# Altium schematic sheet NODE_MCU_V2.SchDoc: PDOA Kit Node
size A3; Organization: Decawave Ltd.; Address1: Adelaide Chambers,; Address2: Peter Street,; Address3: Dublin 8,; Address4: Ireland.; DocumentNumber: 2; Revision: 2v2; SheetNumber: 2; SheetTotal: 5; SheetFunction: MCU; ProjectName: PDOA Kit Node
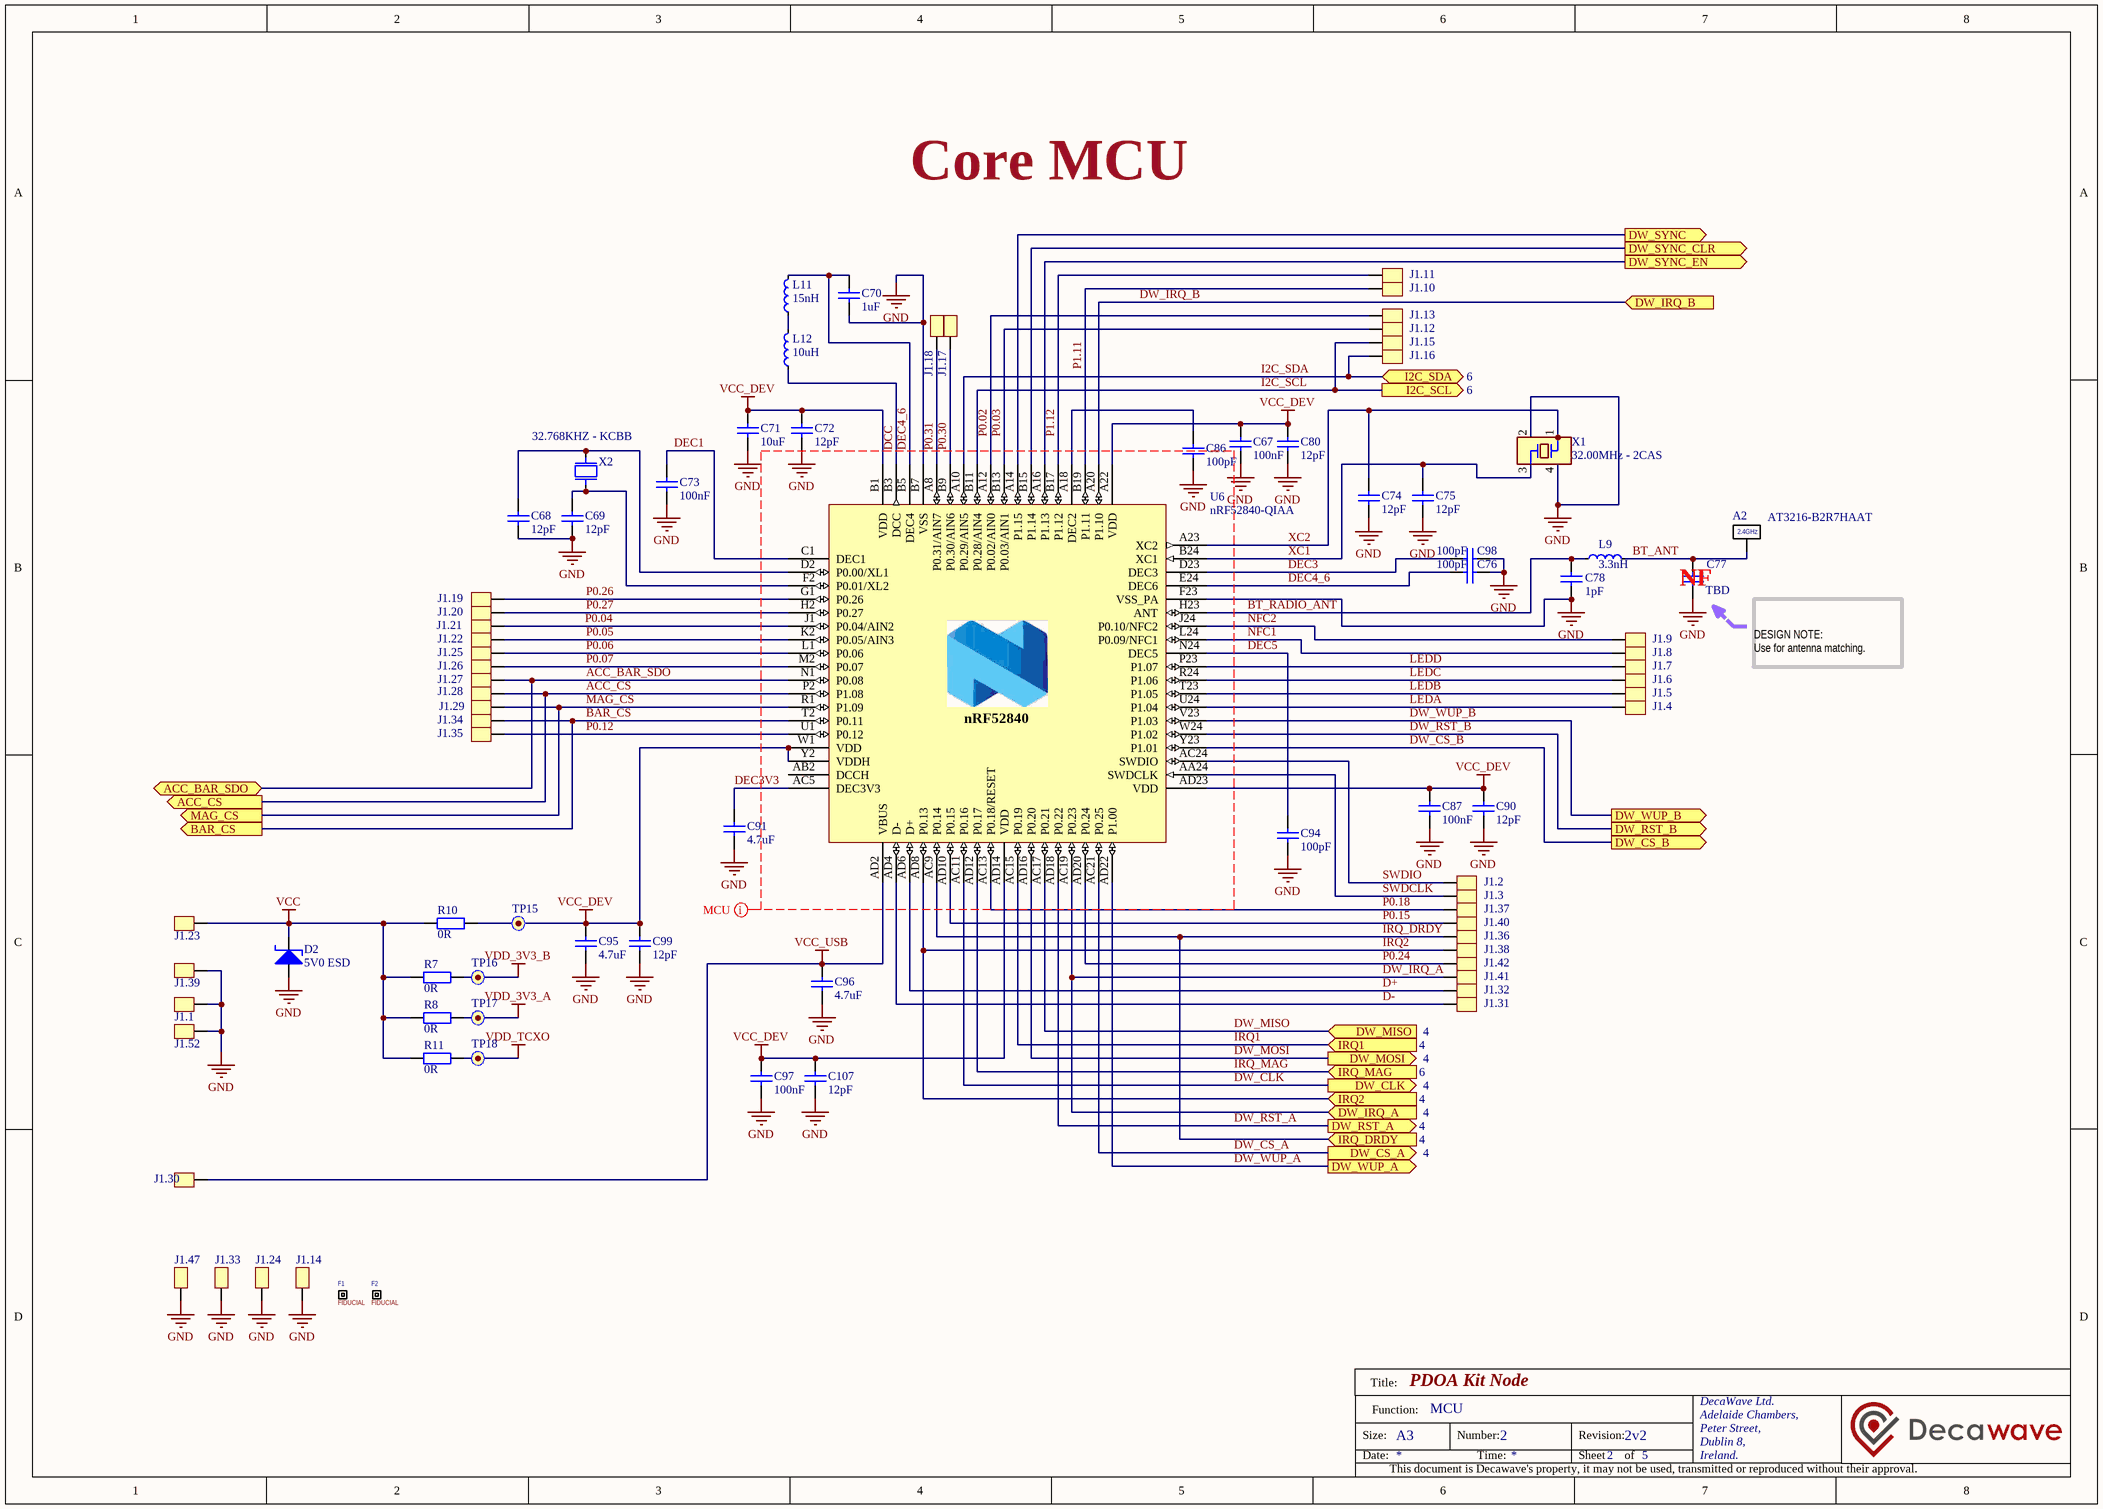
[diagram p0: NODE_MCU_V2.SchDoc]

## Parts
A2  AT3216-B2R7HAAT  [AT3216]
C67  100nF  [C0201]
C68  12pF  [C0201]
C69  12pF  [C0201]
C70  1uF  [C0402]
C71  10uF  [C0603]
C72  12pF  [C0201]
C73  100nF  [C0201]
C74  12pF  [C0201]
C75  12pF  [C0201]
C76  100pF  [C0201]
C77  TBD  [C0201]
C78  1pF  [C0201]
C80  12pF  [C0201]
C86  100pF  [C0201]
C87  100nF  [C0201]
C90  12pF  [C0201]
C91  4.7uF  [C0603]
C94  100pF  [C0201]
C95  4.7uF  [C0603]
C96  4.7uF  [C0603]
C97  100nF  [C0201]
C98  100pF  [C0201]
C99  12pF  [C0201]
C107  12pF  [C0201]
D2  5V0 ESD  [DFN65P100X40-2N]
F1  FIDUCIAL  [FID1]
F2  FIDUCIAL  [FID1]
J1.1  EDGE_PIN  [PCB_EDGE_1MM]  (value not drawn)  (no BOM)
J1.2  EDGE_PIN  [PCB_EDGE_1MM]  (value not drawn)
J1.3  EDGE_PIN  [PCB_EDGE_1MM]  (value not drawn)
J1.4  EDGE_PIN  [PCB_EDGE_1MM]  (value not drawn)
J1.5  EDGE_PIN  [PCB_EDGE_1MM]  (value not drawn)
J1.6  EDGE_PIN  [PCB_EDGE_1MM]  (value not drawn)
J1.7  EDGE_PIN  [PCB_EDGE_1MM]  (value not drawn)
J1.8  EDGE_PIN  [PCB_EDGE_1MM]  (value not drawn)
J1.9  EDGE_PIN  [PCB_EDGE_1MM]  (value not drawn)
J1.10  EDGE_PIN  [PCB_EDGE_1MM]  (value not drawn)
J1.11  EDGE_PIN  [PCB_EDGE_1MM]  (value not drawn)
J1.12  EDGE_PIN  [PCB_EDGE_1MM]  (value not drawn)
J1.13  EDGE_PIN  [PCB_EDGE_1MM]  (value not drawn)
J1.14  EDGE_PIN  [PCB_EDGE_1MM]  (value not drawn)
J1.15  EDGE_PIN  [PCB_EDGE_1MM]  (value not drawn)
J1.16  EDGE_PIN  [PCB_EDGE_1MM]  (value not drawn)
J1.17  EDGE_PIN  [PCB_EDGE_1MM]  (value not drawn)
J1.18  EDGE_PIN  [PCB_EDGE_1MM]  (value not drawn)
J1.19  EDGE_PIN  [PCB_EDGE_1MM]  (value not drawn)  (no BOM)
J1.20  EDGE_PIN  [PCB_EDGE_1MM]  (value not drawn)
J1.21  EDGE_PIN  [PCB_EDGE_1MM]  (value not drawn)
J1.22  EDGE_PIN  [PCB_EDGE_1MM]  (value not drawn)  (no BOM)
J1.23  EDGE_PIN  [PCB_EDGE_1MM]  (value not drawn)  (no BOM)
J1.24  EDGE_PIN  [PCB_EDGE_1MM]  (value not drawn)
J1.25  EDGE_PIN  [PCB_EDGE_1MM]  (value not drawn)
J1.26  EDGE_PIN  [PCB_EDGE_1MM]  (value not drawn)
J1.27  EDGE_PIN  [PCB_EDGE_1MM]  (value not drawn)
J1.28  EDGE_PIN  [PCB_EDGE_1MM]  (value not drawn)
J1.29  EDGE_PIN  [PCB_EDGE_1MM]  (value not drawn)
J1.30  EDGE_PIN  [PCB_EDGE_1MM]  (value not drawn)  (no BOM)
J1.31  EDGE_PIN  [PCB_EDGE_1MM]  (value not drawn)
J1.32  EDGE_PIN  [PCB_EDGE_1MM]  (value not drawn)
J1.33  EDGE_PIN  [PCB_EDGE_1MM]  (value not drawn)
J1.34  EDGE_PIN  [PCB_EDGE_1MM]  (value not drawn)
J1.35  EDGE_PIN  [PCB_EDGE_1MM]  (value not drawn)  (no BOM)
J1.36  EDGE_PIN  [PCB_EDGE_1MM]  (value not drawn)
J1.37  EDGE_PIN  [PCB_EDGE_1MM]  (value not drawn)
J1.38  EDGE_PIN  [PCB_EDGE_1MM]  (value not drawn)
J1.39  EDGE_PIN  [PCB_EDGE_1MM]  (value not drawn)  (no BOM)
J1.40  EDGE_PIN  [PCB_EDGE_1MM]  (value not drawn)
J1.41  EDGE_PIN  [PCB_EDGE_1MM]  (value not drawn)
J1.42  EDGE_PIN  [PCB_EDGE_1MM]  (value not drawn)
J1.47  EDGE_PIN  [PCB_EDGE_1MM]  (value not drawn)
J1.52  EDGE_PIN  [PCB_EDGE_1MM]  (value not drawn)  (no BOM)
L9  3.3nH  [L0201]
L11  15nH  [INDC1005X05N]
L12  10uH  [L0603]
R7  0R  [R0201]
R8  0R  [R0402 -RF]
R10  0R  [R0201]
R11  0R  [R0201]
TP15  TP  [TP_40S]  (value not drawn)
TP16  TP  [TP_40S]  (value not drawn)
TP17  TP  [TP_40S]  (value not drawn)
TP18  TP  [TP_40S]  (value not drawn)
U6  nRF52840-QIAA  [AQFN50P700X700X85_HS-74N]
X1  32.00MHz - 2CAS  [ABM10]
X2  32.768KHZ - KCBB  [XTAL_SMD_3.2X1.5MM]

## Ports
ACC_BAR_SDO (bidir), ACC_CS (out), BAR_CS (out), DW_CLK (out, see 4), DW_CS_A (out, see 4), DW_CS_B (out), DW_IRQ_A (in, see 4), DW_IRQ_B (in), DW_MISO (in, see 4), DW_MOSI (out, see 4), DW_RST_A (out, see 4), DW_RST_B (out), DW_SYNC (out), DW_SYNC_CLR (out), DW_SYNC_EN (out), DW_WUP_A (out), DW_WUP_B (out), I2C_SCL (out, see 6), I2C_SDA (bidir, see 6), IRQ1 (in, see 4), IRQ2 (in, see 4), IRQ_DRDY (in, see 4), IRQ_MAG (in, see 6), MAG_CS (out)

## Nets
GND: C67.1 C68.1 C69.1 C70.1 C71.1 C72.1 C73.1 C74.1 C75.1 C76.1 C77.1 C78.1 C80.1 C86.1 C87.1 C90.1 C91.1 C94.1 C95.1 C96.1 C97.1 C98.1 C99.1 C107.1 D2.A J1.1.0 J1.14.0 J1.24.0 J1.33.0 J1.39.0 J1.47.0 J1.52.0 U6.74(GND) U6.B7(VSS) U6.F23(VSS_PA) X1.2 X1.4
VCC: D2.K J1.23.0 R7.1 R8.1 R10.1 R11.1
VCC_DEV: C67.2 C71.2 C72.2 C80.2 C87.2 C90.2 C95.2 C97.2 C99.2 C107.2 R10.2 TP15.1 U6.A22(VDD) U6.AD14(VDD) U6.AD23(VDD) U6.B1(VDD) U6.W1(VDD) U6.Y2(VDDH)
VCC_USB: C96.2 J1.30.0 U6.AD2(VBUS)
VDD_3V3_A: R8.2 TP17.1
VDD_3V3_B: R7.2 TP16.1
VDD_TCXO: R11.2 TP18.1
ACC_BAR_SDO: J1.27.0 U6.N1(P0.08) ; port ACC_BAR_SDO
ACC_CS: J1.28.0 U6.P2(P1.08) ; port ACC_CS
BAR_CS: J1.34.0 U6.T2(P0.11) ; port BAR_CS
BT_ANT: A2.1 C77.2 L9.2
BT_RADIO_ANT: C78.2 L9.1 U6.H23(ANT)
D+: J1.32.0 U6.AD6(D+)
D-: J1.31.0 U6.AD4(D-)
DCC: L12.1 U6.B3(DCC)
DEC1: C73.2 U6.C1(DEC1)
DEC3: C98.2 U6.D23(DEC3)
DEC3V3: C91.2 U6.AC5(DEC3V3)
DEC4_6: C70.2 C76.2 L11.2 U6.B5(DEC4) U6.E24(DEC6)
DEC5: C94.2 U6.N24(DEC5)
DW_CLK: U6.AC11(P0.16) ; port DW_CLK
DW_CS_A: U6.AC21(P0.25) ; port DW_CS_A
DW_CS_B: U6.Y23(P1.01) ; port DW_CS_B
DW_IRQ_A: J1.41.0 U6.AC19(P0.23) ; port DW_IRQ_A
DW_IRQ_B: U6.A20(P1.10) ; port DW_IRQ_B
DW_MISO: U6.AC17(P0.21) ; port DW_MISO
DW_MOSI: U6.AD16(P0.20) ; port DW_MOSI
DW_RST_A: U6.AD18(P0.22) ; port DW_RST_A
DW_RST_B: U6.W24(P1.02) ; port DW_RST_B
DW_SYNC: U6.A14(P1.15) ; port DW_SYNC
DW_SYNC_CLR: U6.B15(P1.14) ; port DW_SYNC_CLR
DW_SYNC_EN: U6.A16(P1.13) ; port DW_SYNC_EN
DW_WUP_A: U6.AD22(P1.00) ; port DW_WUP_A
DW_WUP_B: U6.V23(P1.03) ; port DW_WUP_B
I2C_SCL: J1.15.0 U6.B11(P0.28/AIN4) ; port I2C_SCL
I2C_SDA: J1.16.0 U6.A10(P0.29/AIN5) ; port I2C_SDA
IRQ1: U6.AC15(P0.19) ; port IRQ1
IRQ2: J1.38.0 U6.AD8(P0.13) ; port IRQ2
IRQ_DRDY: J1.36.0 U6.AC9(P0.14) ; port IRQ_DRDY
IRQ_MAG: U6.AD12(P0.17) ; port IRQ_MAG
LEDA: J1.4.0 U6.U24(P1.04)
LEDB: J1.5.0 U6.T23(P1.05)
LEDC: J1.6.0 U6.R24(P1.06)
LEDD: J1.7.0 U6.P23(P1.07)
MAG_CS: J1.29.0 U6.R1(P1.09) ; port MAG_CS
NFC1: J1.8.0 U6.L24(P0.09/NFC1)
NFC2: J1.9.0 U6.J24(P0.10/NFC2)
P0.02: J1.13.0 U6.A12(P0.02/AIN0)
P0.03: J1.12.0 U6.B13(P0.03/AIN1)
P0.04: J1.21.0 U6.J1(P0.04/AIN2)
P0.05: J1.22.0 U6.K2(P0.05/AIN3)
P0.06: J1.25.0 U6.L1(P0.06)
P0.07: J1.26.0 U6.M2(P0.07)
P0.12: J1.35.0 U6.U1(P0.12)
P0.15: J1.40.0 U6.AD10(P0.15)
P0.18: J1.37.0 U6.AC13(P0.18/RESET)
P0.24: J1.42.0 U6.AD20(P0.24)
P0.26: J1.19.0 U6.G1(P0.26)
P0.27: J1.20.0 U6.H2(P0.27)
P0.30: J1.17.0 U6.B9(P0.30/AIN6)
P0.31: J1.18.0 U6.A8(P0.31/AIN7)
P1.11: J1.10.0 U6.B19(P1.11)
P1.12: J1.11.0 U6.B17(P1.12)
SWDCLK: J1.3.0 U6.AA24(SWDCLK)
SWDIO: J1.2.0 U6.AC24(SWDIO)
XC1: C75.2 U6.B24(XC1) X1.3
XC2: C74.2 U6.A23(XC2) X1.1
NetC68_2: C68.2 U6.D2(P0.00/XL1) X2.2
NetC69_2: C69.2 U6.F2(P0.01/XL2) X2.1
NetC86_2: C86.2 U6.A18(DEC2)
NetL11_1: L11.1 L12.2

Not connected (* = marked no-connect by the designer): U6 AB2(DCCH)

## Layout directives
net class BGA: DCC, DEC4_6, GND, P0.30, P0.31

## Notes on the sheet
- Core MCU
- (near C77) NF
- DESIGN NOTE:
  Use for antenna matching.
- Title:
- Size:
- Date:
- Function:
- A3
- Number:
- Time:
- Revision:
- Sheet
- of
- DecaWave Ltd.
- Adelaide Chambers,
- Peter Street,
- Dublin 8,
- Ireland.
- This document is Decawave's property, it may not be used, transmitted or reproduced without their approval.
- (in symbol AT3216-B2R7HAAT) 2.4GHz
- (in symbol nRF52840_QIAA) nRF52840

## Library data of the parts
A2 = AT3216-B2R7HAAT: CHIP, 2.45GHZ, 50 OHM, 3.2x1.6 ACX - AAT3216-B2R7HAAT- ANTENNA; Manufacturer Part Number: AMCA31-2R450G-S1F-T; Manufacturer: ACX
C67 C73 C87 C97 = GRM033C81E104ME14D: 100nF_0201_10%; Manufacturer: Murata Electronics North America; Manufacturer Part Number: GRM033C81E104KE14D
C68 C69 C72 C74 C75 C80 C90 C99 C107 = GRM0335C1E120JA01D: 12pF_0201_1%; Manufacturer: Murata Electronics North America; Manufacturer Part Number: GRM0335C1E120JA01D
C70 = GRM155R61A105KE15D: CAP CER 1UF 10V X5R 0402; Manufacturer: Murata Electronics North America; Manufacturer Part Number: GRM155R61A105KE15D
C71 = GRM188R60J106ME84D: CAP CER 10UF 6.3V X5R 0603; Manufacturer: Murata Electronics North America; Manufacturer Part Number: GRM188R60J106ME47D
C76 C86 C94 C98 = GRM0335C1E101JA01D: CAP CER 100PF 25V NP0 0201; Manufacturer: Murata Electronics North America; Manufacturer Part Number: GRM0335C1E101JA01D
C77 C78 = GRM0335C1H1R0BA01D: CAP CER 1PF 50V NP0 0201; Manufacturer: Murata Electronics North America; Manufacturer Part Number: GRM0335C1H1R0BA01D
C91 C95 C96 = GRM188R60J106ME84D: CAP CER 4.7UF 6.3V X5R 0603; Manufacturer: SamSung; Manufacturer Part Number: CL10A475KQ8NNN#
D2 = DF2S6.2CT,L3F: TVS DIODE 5VWM; Manufacturer: Toshiba Semiconductor and Storage; Manufacturer Part Number: DF2S6.2CT,L3F
F1 F2 = FID1: Fiducial 1mm
J1.1-J1.42 J1.47 J1.52 = EDGE_PIN: PCB Edge pin
L9 = LQP03TG3N3C02D: FIXED IND 3.3NH 400MA 320 MOHM; Manufacturer: Murata Electronics North America; Manufacturer Part Number: LQP03TG3N3C02D
L11 = HK100515NJ-T: FIXED IND 15NH 320MA 460 MOHM; Manufacturer: Taiyo Yuden; Manufacturer Part Number: HK100515NJ-T
L12 = LBMF1608T100K: FIXED IND 10UH 80MA 360 MOHM SMD; Manufacturer: Taiyo Yuden; Manufacturer Part Number: LBMF1608T100K
R7 R10 R11 = RC0201JR-070RL: RES SMD 0.0OHM JUMPER 1/20W 0201; Manufacturer: Yageo; Manufacturer Part Number: RC0201JR-070RL
R8 = RC0201JR-070RL: RES SMD 0.0OHM JUMPER 1/20W 0402; Manufacturer: Yageo; Manufacturer Part Number: RC0402JR-070RL
TP15-TP18 = TP: test point
U6 = nRF52840_QIAA: Multi-protocol Bluetooth Low Energy, IEEE 802.15.4, ANT and 2.4GHz proprietary system-on-chip; Manufacturer: Nordic Semiconductor ASA; Note: *; Manufacturer Part Number: nRF52840-QIAA
X1 = ABM10: CRYSTAL 32MHZ 8PF SMD; Manufacturer: Commutek; Manufacturer Part Number: 2CAS
X2 = ABS06-32.768KHZ-T: CRYSTAL 32.7680KHZ 12.5PF SMD; Manufacturer: Commutek; Manufacturer Part Number: KCBB